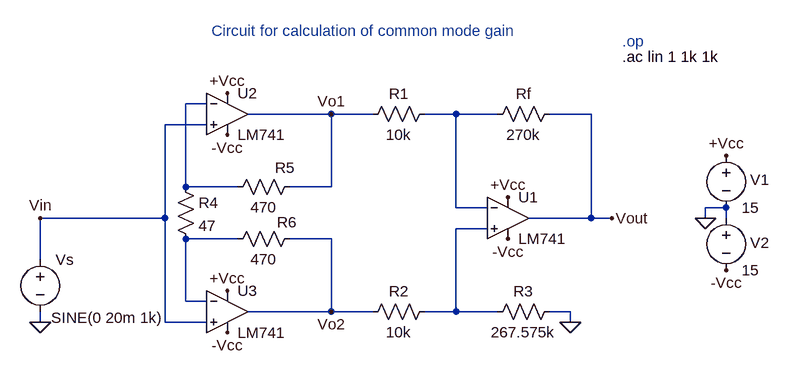
[diagram p0: schematic CMgain.asc]
CMgain.asc, the LTspice schematic file:
Version 4
SHEET 1 880 680
WIRE -288 32 -320 32
WIRE -96 48 -224 48
WIRE -32 48 -96 48
WIRE 96 48 48 48
WIRE 160 48 96 48
WIRE 304 48 240 48
WIRE -288 64 -352 64
WIRE -320 160 -320 32
WIRE -240 160 -320 160
WIRE -96 160 -96 48
WIRE -96 160 -160 160
WIRE 96 192 96 48
WIRE 144 192 96 192
WIRE 512 192 480 192
WIRE -352 208 -352 64
WIRE -352 208 -544 208
WIRE 304 208 304 48
WIRE 304 208 208 208
WIRE 336 208 304 208
WIRE 480 208 480 192
WIRE 512 208 512 192
WIRE 144 224 96 224
WIRE -240 240 -320 240
WIRE -96 240 -160 240
WIRE -544 272 -544 208
WIRE -320 336 -320 240
WIRE -288 336 -320 336
WIRE -96 352 -96 240
WIRE -96 352 -224 352
WIRE -32 352 -96 352
WIRE 96 352 96 224
WIRE 96 352 48 352
WIRE 160 352 96 352
WIRE 272 352 240 352
WIRE -544 368 -544 352
WIRE -352 368 -352 208
WIRE -288 368 -352 368
WIRE 272 368 272 352
FLAG 512 112 +Vcc
FLAG 512 288 -Vcc
FLAG 480 208 0
FLAG 272 368 0
FLAG 176 176 +Vcc
FLAG 176 240 -Vcc
FLAG 336 208 Vout
FLAG -256 16 +Vcc
FLAG -256 80 -Vcc
FLAG -256 320 +Vcc
FLAG -256 384 -Vcc
FLAG -544 368 0
FLAG -544 208 Vin
FLAG -96 48 Vo1
FLAG -96 352 Vo2
SYMBOL voltage 512 96 R0
WINDOW 0 37 53 Left 2
SYMATTR InstName V1
SYMATTR Value 15
SYMBOL voltage 512 192 R0
WINDOW 0 37 54 Left 2
SYMATTR InstName V2
SYMATTR Value 15
SYMBOL Opamps\\LM741 176 144 R0
SYMATTR InstName U1
SYMBOL res 64 32 R90
WINDOW 0 0 56 VBottom 2
WINDOW 3 32 56 VTop 2
SYMATTR InstName R1
SYMATTR Value 10k
SYMBOL res 64 336 R90
WINDOW 0 0 56 VBottom 2
WINDOW 3 32 56 VTop 2
SYMATTR InstName R2
SYMATTR Value 10k
SYMBOL res 256 336 R90
WINDOW 0 0 56 VBottom 2
WINDOW 3 32 56 VTop 2
SYMATTR InstName R3
SYMATTR Value 267.575k
SYMBOL res 256 32 R90
WINDOW 0 0 56 VBottom 2
WINDOW 3 32 56 VTop 2
SYMATTR InstName Rf
SYMATTR Value 270k
SYMBOL Opamps\\LM741 -256 -16 R0
SYMATTR InstName U2
SYMBOL Opamps\\LM741 -256 288 R0
SYMATTR InstName U3
SYMBOL res -144 144 R90
WINDOW 0 2 23 VBottom 2
WINDOW 3 32 56 VTop 2
SYMATTR InstName R5
SYMATTR Value 470
SYMBOL res -144 224 R90
WINDOW 0 6 20 VBottom 2
WINDOW 3 32 56 VTop 2
SYMATTR InstName R6
SYMATTR Value 470
SYMBOL res -336 144 R0
SYMATTR InstName R4
SYMATTR Value 47
SYMBOL voltage -544 256 R0
WINDOW 3 17 105 Left 2
WINDOW 39 0 0 Left 2
SYMATTR Value SINE(0 20m 1k)
SYMATTR InstName Vs
SYMATTR Value2 AC 0.02 0
TEXT 352 -64 Left 2 ;.op
TEXT 352 -40 Left 2 !.ac lin 1 1k 1k
TEXT -280 -80 Left 2 ;Circuit for calculation of common mode gain

The netlist it stands for:
* CMgain.asc
V1 +Vcc 0 15
V2 0 -Vcc 15
XU1 N003 N002 +Vcc -Vcc Vout LM741  ; pins In+ In- V+ V- OUT
R1 N002 Vo1 10k
R2 N003 Vo2 10k
R3 0 N003 267.575k
Rf Vout N002 270k
XU2 Vin N001 +Vcc -Vcc Vo1 LM741  ; pins In+ In- V+ V- OUT
XU3 Vin N004 +Vcc -Vcc Vo2 LM741  ; pins In+ In- V+ V- OUT
R5 Vo1 N001 470
R6 Vo2 N004 470
R4 N001 N004 47
Vs Vin 0 SINE(0 20m 1k) AC 0.02 0
* .op
.ac lin 1 1k 1k
* Circuit for calculation of common mode gain
.lib LM741.lib
.backanno
.end